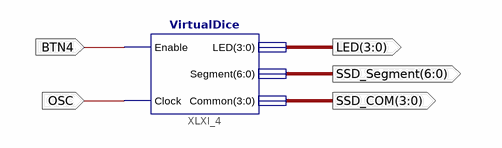
[diagram p0: schematic sheet 1]
// Xilinx ISE schematic Lab6.sch (spartan6) as structural Verilog: 1 symbols, 5 ports
module Lab6 (
  input  OSC,
  input  BTN4,
  output [6:0] SSD_Segment,
  output [3:0] LED,
  output [3:0] SSD_COM
);

  VirtualDice XLXI_4 (.Enable(BTN4), .Clock(OSC), .LED(LED), .Segment(SSD_Segment), .Common(SSD_COM));
endmodule
